# EAGLE design SOT23-3 (EAGLE 7.1.0)
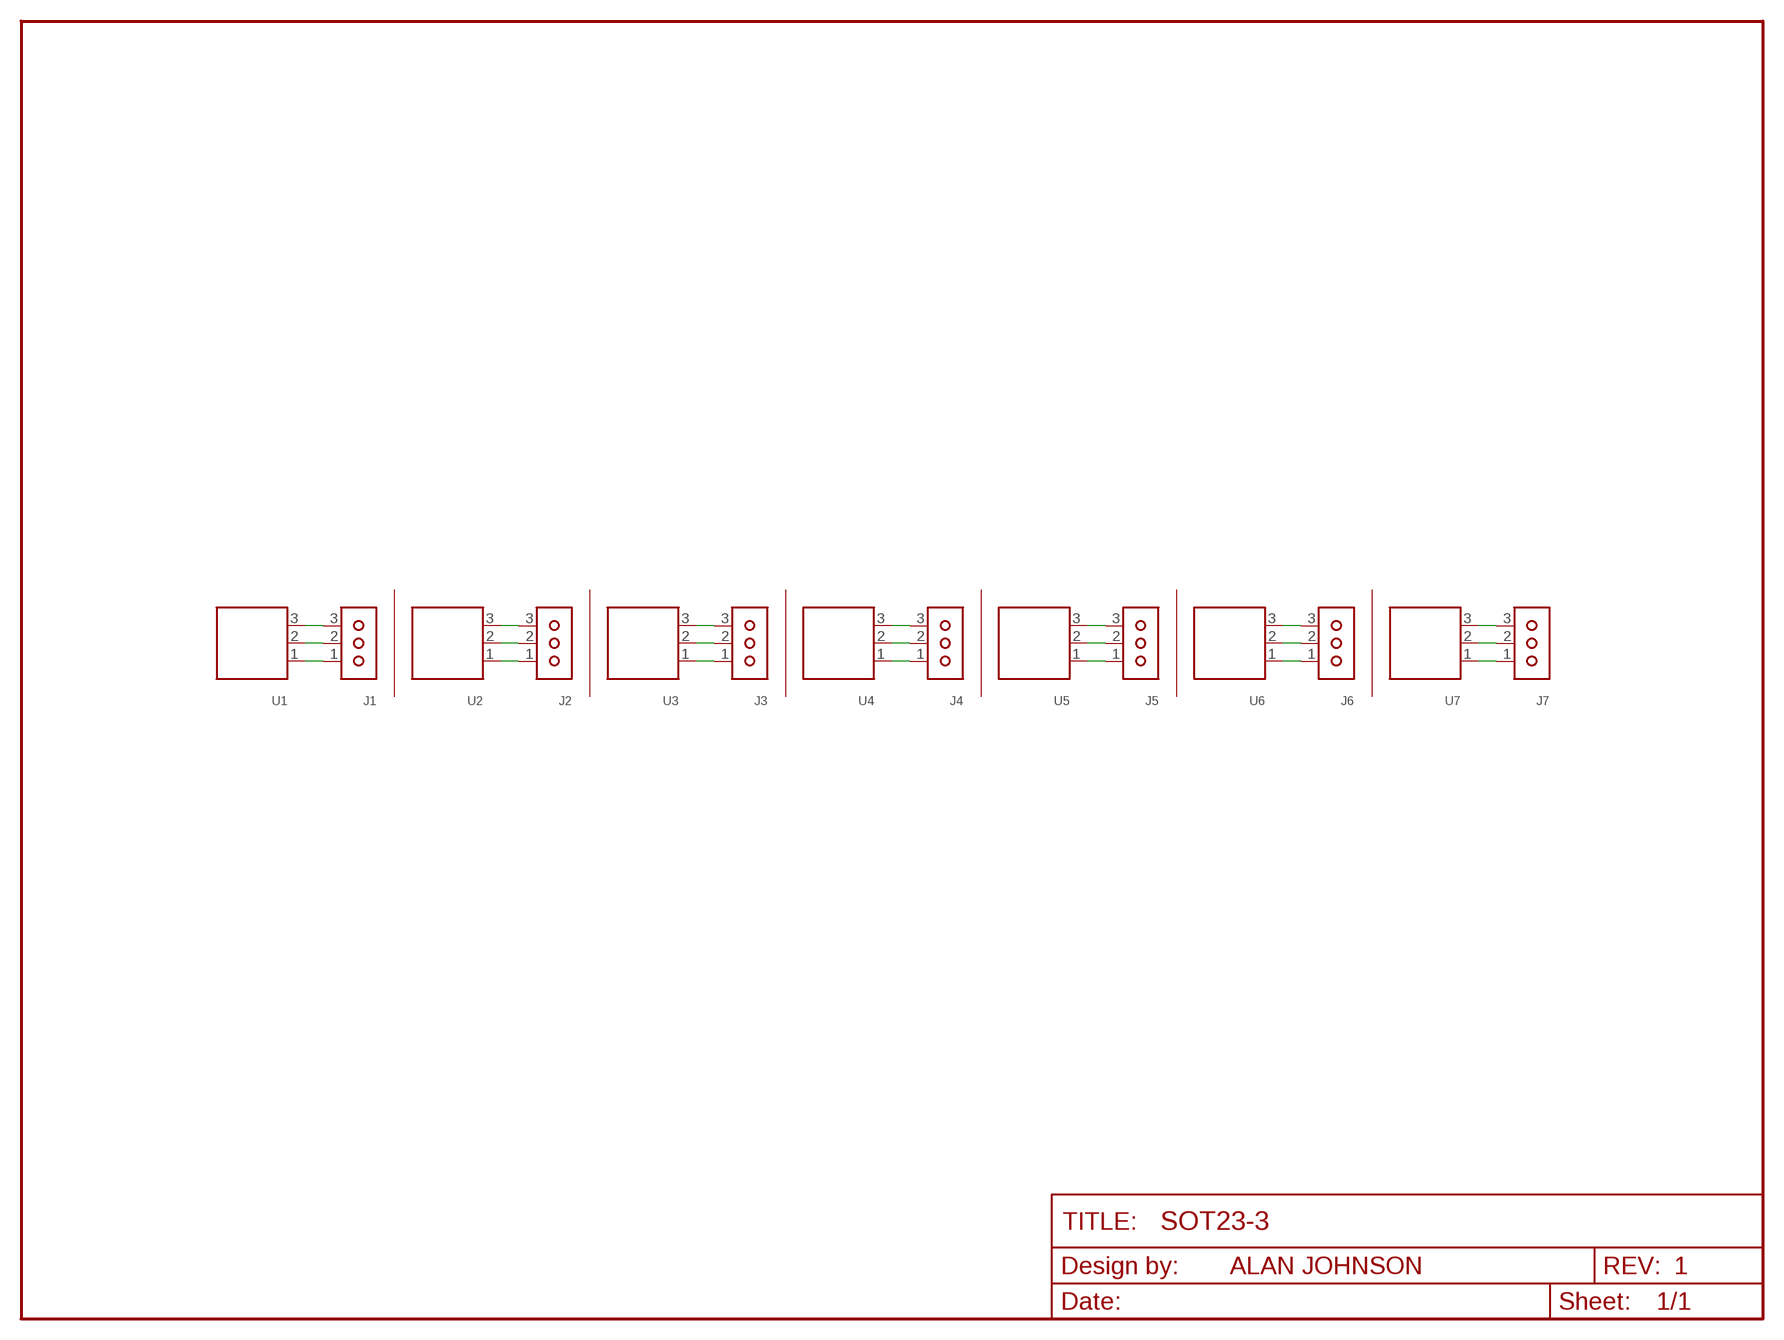
[diagram p0: schematic, sheet 1]

## Parts
J1  1X03  [1X03]
J2  1X03  [1X03]
J3  1X03  [1X03]
J4  1X03  [1X03]
J5  1X03  [1X03]
J6  1X03  [1X03]
J7  1X03  [1X03]
U1  SOT23-3  [SOT23-3]
U2  SOT23-3  [SOT23-3]
U3  SOT23-3  [SOT23-3]
U4  SOT23-3  [SOT23-3]
U5  SOT23-3  [SOT23-3]
U6  SOT23-3  [SOT23-3]
U7  SOT23-3  [SOT23-3]

## Nets
N$1: J1.1 U1.1
N$2: J1.2 U1.2
N$3: J1.3 U1.3
N$4: J2.1 U2.1
N$5: J2.2 U2.2
N$6: J2.3 U2.3
N$7: J3.1 U3.1
N$8: J3.2 U3.2
N$9: J3.3 U3.3
N$10: J4.1 U4.1
N$11: J4.2 U4.2
N$12: J4.3 U4.3
N$13: J5.1 U5.1
N$14: J5.2 U5.2
N$15: J5.3 U5.3
N$16: J6.1 U6.1
N$17: J6.2 U6.2
N$18: J6.3 U6.3
N$19: J7.1 U7.1
N$20: J7.2 U7.2
N$21: J7.3 U7.3

## Notes on the sheet
- ALAN JOHNSON | 1

## Library data of the parts
J1-J7 = breakouts:1X03: 1x03 pin headers
U1-U7 = breakouts:SOT23-3: Small Outline Transitor - 3 Leads

## Board
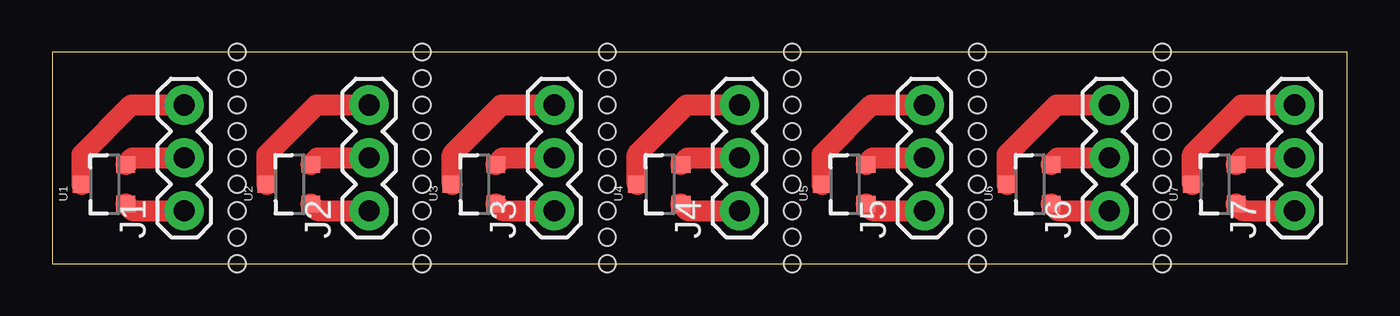
[diagram p1: board, top side]
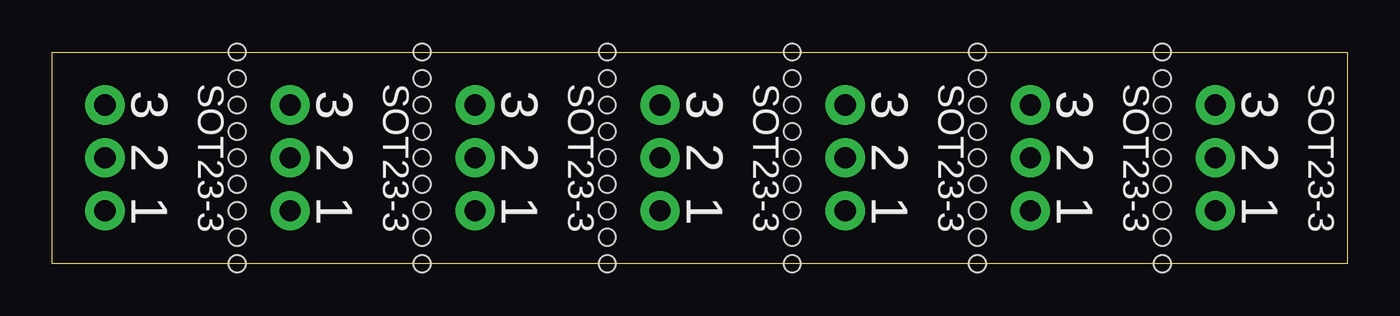
[diagram p2: board, bottom side, seen from below]

Size 62.23 x 10.16 mm. Coordinates in mm from the lower left corner, seen from the top.
Outline: 0,0 62.23,0 62.23,10.16 0,10.16 0,0
Copper layers (1*16): Top 0.0356mm / dielectric 1.5011mm / Bottom 0.0356mm
Design rules "breakouts *": minimum track width 6mil, minimum drill 13mil, track to track 6mil, track to pad 6mil, pad to pad 6mil, via to via 6mil, smd to smd 6mil, copper to edge 15mil, drill to drill 6mil, minimum pad ring 7mil, minimum via ring 7mil, stop-mask expansion 3mil, vias tented up to drill 0mil, thermal gap 10mil
Holes 0.8 mm at 8.89,10.16 8.89,8.89 8.89,7.62 8.89,6.35 8.89,5.08 8.89,3.81 8.89,2.54 8.89,1.27 8.89,0 17.78,10.16 17.78,8.89 17.78,7.62 17.78,6.35 17.78,5.08 17.78,3.81 17.78,2.54 17.78,1.27 17.78,0 26.67,10.16 26.67,8.89 26.67,7.62 26.67,6.35 26.67,5.08 26.67,3.81 26.67,2.54 26.67,1.27 26.67,0 35.56,10.16 35.56,8.89 35.56,7.62 35.56,6.35 35.56,5.08 35.56,3.81 35.56,2.54 35.56,1.27 35.56,0 44.45,10.16 44.45,8.89 44.45,7.62 44.45,6.35 44.45,5.08 44.45,3.81 44.45,2.54 44.45,1.27 44.45,0 53.34,10.16 53.34,8.89 53.34,7.62 53.34,6.35 53.34,5.08 53.34,3.81 53.34,2.54 53.34,1.27 53.34,0

### Footprints (pad centres in the part's own frame; a part is rotated, then mirrored left to right if it is on the bottom)
1X03 = drill 1.016 pad 1.88: 1 0,0; 2 2.54,0; 3 5.08,0
SOT23-3 = smd 0.8 x 0.9: 1 -0.95,-1; 2 0.95,-1; 3 0,1.1

### Placement (x,y rotation side)
J1  6.35,2.54 90 top
J2  15.24,2.54 90 top
J3  24.13,2.54 90 top
J4  33.02,2.54 90 top
J5  41.91,2.54 90 top
J6  50.8,2.54 90 top
J7  59.69,2.54 90 top
U1  2.54,3.81 90 top
U2  11.43,3.81 90 top
U3  20.32,3.81 90 top
U4  29.21,3.81 90 top
U5  38.1,3.81 90 top
U6  46.99,3.81 90 top
U7  55.88,3.81 90 top

### Tracks (layer width: path | path; a pad name or v marks a point on that pad's centre or on a via)
N$1
  Top 1.016: U1.1 3.86,2.54 J1.1
N$2
  Top 1.016: U1.2 3.86,5.08 J1.2
N$3
  Top 1.016: U1.3 1.44,5.25 3.81,7.62 J1.3
N$4
  Top 1.016: U2.1 12.75,2.54 J2.1
N$5
  Top 1.016: U2.2 12.75,5.08 J2.2
N$6
  Top 1.016: U2.3 10.33,5.25 12.7,7.62 J2.3
N$7
  Top 1.016: U3.1 21.64,2.54 J3.1
N$8
  Top 1.016: U3.2 21.64,5.08 J3.2
N$9
  Top 1.016: U3.3 19.22,5.25 21.59,7.62 J3.3
N$10
  Top 1.016: U4.1 30.53,2.54 J4.1
N$11
  Top 1.016: U4.2 30.53,5.08 J4.2
N$12
  Top 1.016: U4.3 28.11,5.25 30.48,7.62 J4.3
N$13
  Top 1.016: U5.1 39.42,2.54 J5.1
N$14
  Top 1.016: U5.2 39.42,5.08 J5.2
N$15
  Top 1.016: U5.3 37,5.25 39.37,7.62 J5.3
N$16
  Top 1.016: U6.1 48.31,2.54 J6.1
N$17
  Top 1.016: U6.2 48.31,5.08 J6.2
N$18
  Top 1.016: U6.3 45.89,5.25 48.26,7.62 J6.3
N$19
  Top 1.016: U7.1 57.2,2.54 J7.1
N$20
  Top 1.016: U7.2 57.2,5.08 J7.2
N$21
  Top 1.016: U7.3 54.78,5.25 57.15,7.62 J7.3

### Text on the board
bPlace: 3 | 3 | 3 | 3 | 3 | 3 | 3 | SOT23-3 | 2 | SOT23-3 | 2 | SOT23-3 | 2 | SOT23-3 | 2 | SOT23-3 | 2 | SOT23-3 | 2 | SOT23-3 | 2 | 1 | 1 | 1 | 1 | 1 | 1 | 1